# EAGLE design untitled (EAGLE 9.5.0)
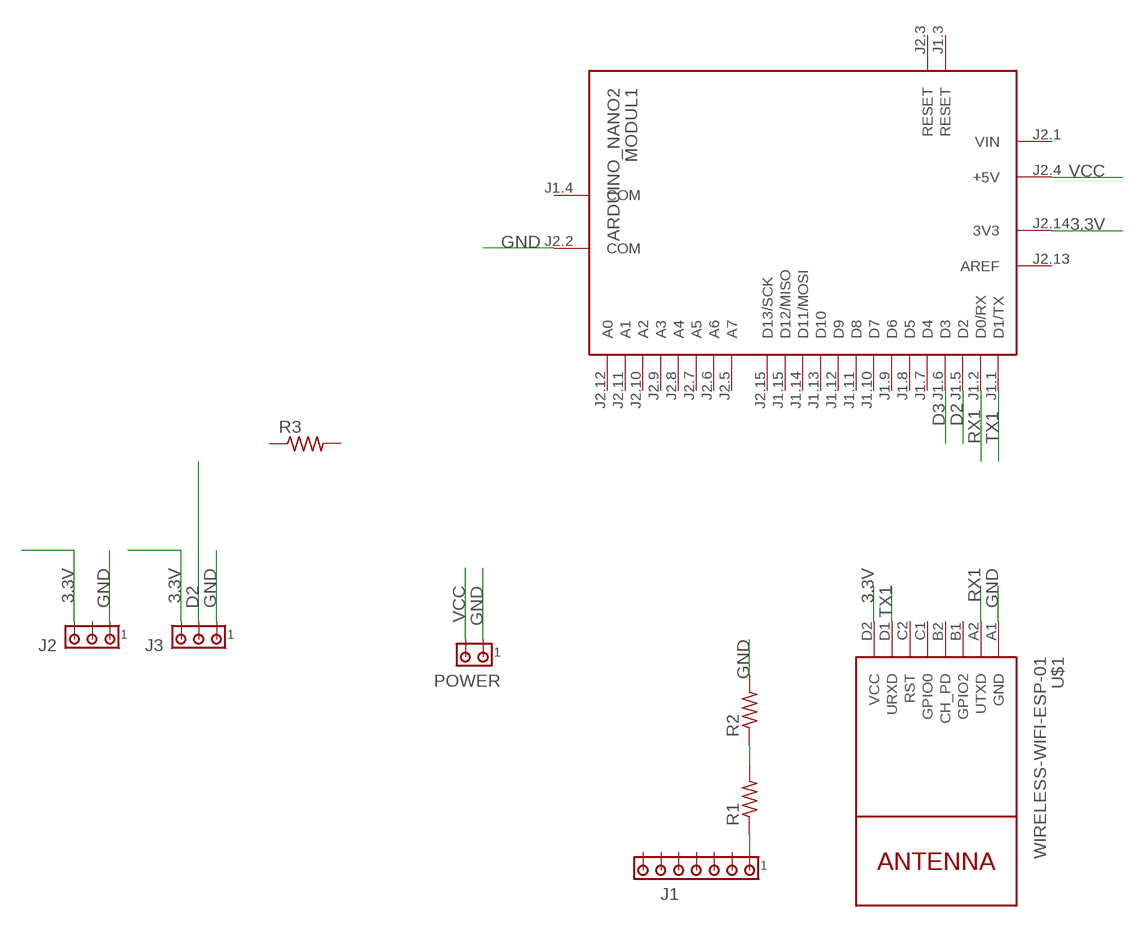
[diagram p0: schematic, sheet 1]

## Parts
J1  MTA07-100  [10X07MTA]
J2  MTA03-100  [10X03MTA]
J3  MTA03-100  [10X03MTA]
MODUL1  ARDUINO_NANO2  [ARDUINO_NANO2]
POWER  MTA02-100  [10X02MTA]
R1  R-US_0207/9  [0207/9]
R2  R-US_0207/9  [0207/9]
R3  R-US_0207/9  [0207/9]
U$1  WIRELESS-WIFI-ESP-01  [WIRELESS-WIFI-ESP-01]

## Nets
3.3V: J2.3 J3.3 MODUL1.J2.14(3V3) U$1.D2(VCC)
D2: J3.2 MODUL1.J1.5(D2)
D3: MODUL1.J1.6(D3)
GND: J2.1 J3.1 MODUL1.J2.2(COM) POWER.1 R2.2 U$1.A1(GND)
N$1: R1.2 R2.1
N$2: J1.1 R1.1
RX1: MODUL1.J1.2(D0/RX) U$1.A2(UTXD)
TX1: MODUL1.J1.1(D1/TX) U$1.D1(URXD)
VCC: MODUL1.J2.4(+5V) POWER.2
Unconnected: J1.2 J1.3 J1.4 J1.5 J1.6 J1.7 J2.2 MODUL1.J1.3(RESET) MODUL1.J1.7(D4) MODUL1.J1.8(D5) MODUL1.J1.9(D6) MODUL1.J1.10(D7) MODUL1.J1.11(D8) MODUL1.J1.12(D9) MODUL1.J1.13(D10) MODUL1.J1.14(D11/MOSI) MODUL1.J1.15(D12/MISO) MODUL1.J2.3(RESET) MODUL1.J2.5(A7) MODUL1.J2.6(A6) MODUL1.J2.7(A5) MODUL1.J2.8(A4) MODUL1.J2.9(A3) MODUL1.J2.10(A2) MODUL1.J2.11(A1) MODUL1.J2.12(A0) MODUL1.J2.15(D13/SCK) R3.1 R3.2 U$1.B1(GPIO2) U$1.B2(CH_PD) U$1.C1(GPIO0) U$1.C2(RST)

## Power pins joined to a net without a drawn wire
AREF: MODUL1.J2.13(AREF)
COM: MODUL1.J1.4(COM)
VIN: MODUL1.J2.1(VIN)

## Library data of the parts
J1 = con-amp:MTA07-100: AMP connector
J2 J3 = con-amp:MTA03-100: AMP connector
MODUL1 = arduino:ARDUINO_NANO2: Arduino Nano2 Auto generated by modulcreator.ulp \;; ANZAHL: 2; MODUL: TRUE; STECKX0: -76200; STECKX1: 76200; STECKY0: 177800; STECKY1: 177800
POWER = con-amp:MTA02-100: AMP connector
R1-R3 = adafruit:R-US_: RESISTOR, American symbol
U$1 = diy-modules:WIRELESS-WIFI-ESP-01: Wireless Wi-Fi ESP-01 Module based on ESP8266 chip Click here to find device on ebay.com <http://www.ebay.com/sch/esp8266+esp+01+transceiver>

## Board
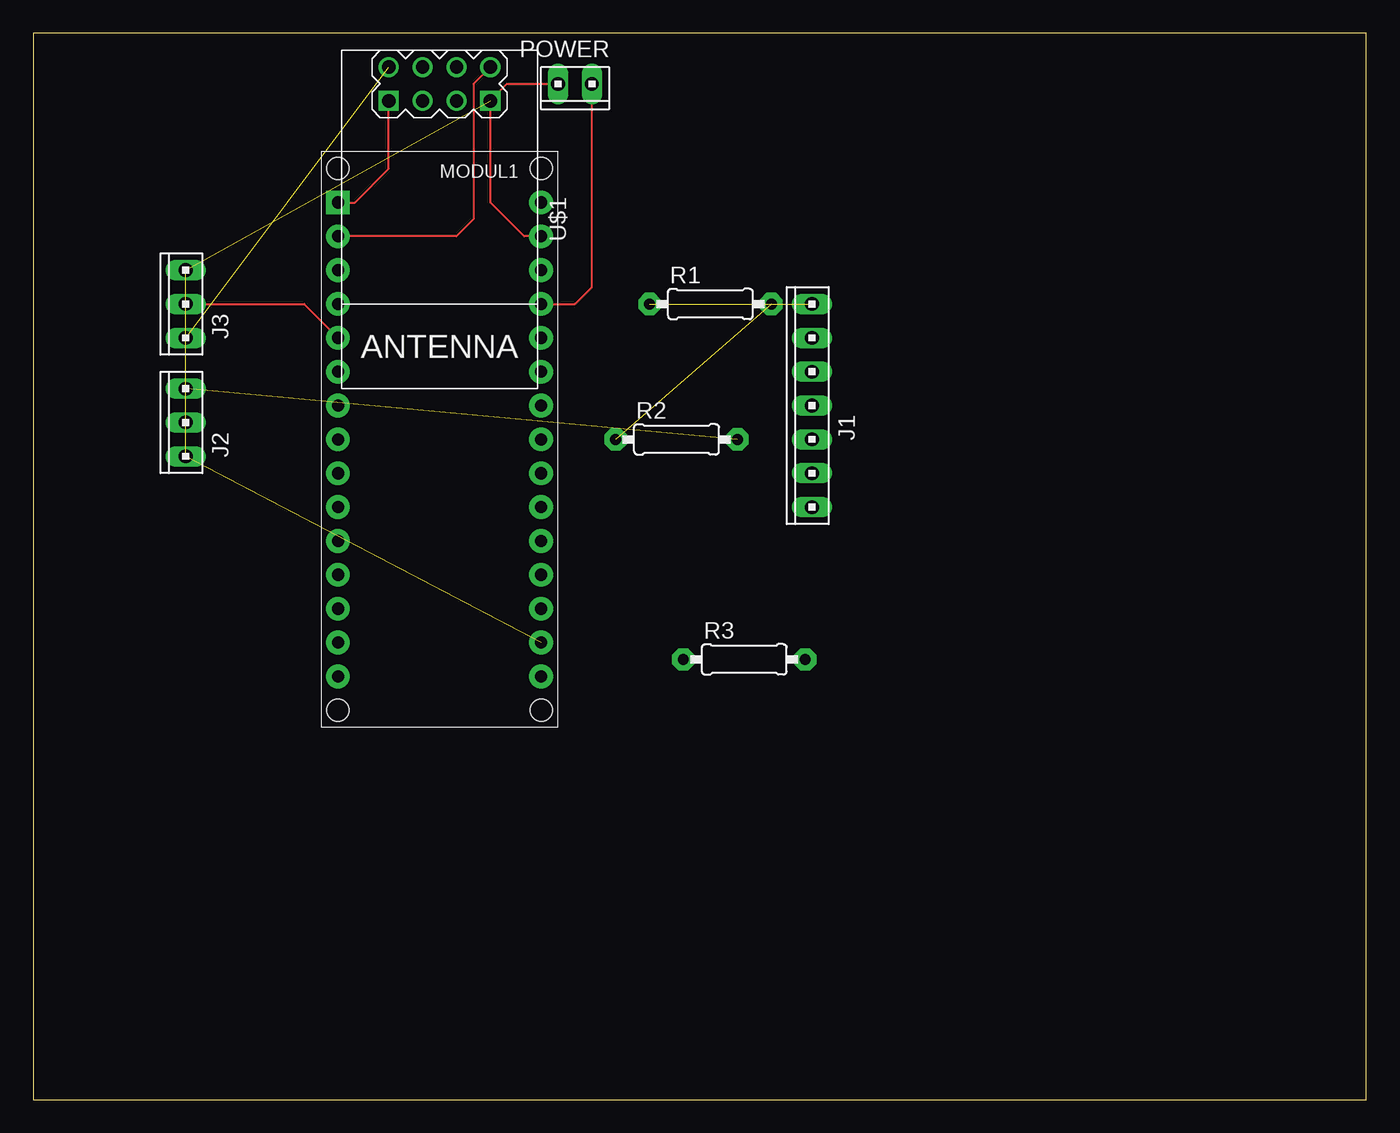
[diagram p1: board, top side]

Size 100 x 80 mm. Coordinates in mm from the lower left corner, seen from the top.
Outline: 0,0 100,0 100,80 0,80 0,0
Copper layers (1*16): Top 0.035mm / dielectric 1.5mm / Bottom 0.035mm
Design rules "default": minimum track width 6mil, minimum drill 0.35mm, track to track 6mil, track to pad 6mil, pad to pad 6mil, via to via 6mil, smd to smd 6mil, copper to edge 40mil, drill to drill 6mil, minimum pad ring 10mil, minimum via ring 8mil, stop-mask expansion 4mil, vias tented up to drill 0mil, thermal gap 10mil

### Footprints (pad centres in the part's own frame; a part is rotated, then mirrored left to right if it is on the bottom)
10X07MTA = drill 1.016 long: 1 7.62,0; 2 5.08,0; 3 2.54,0; 4 0,0; 5 -2.54,0; 6 -5.08,0; 7 -7.62,0
10X03MTA = drill 1.016 long: 1 2.54,0; 2 0,0; 3 -2.54,0
ARDUINO_NANO2 = drill 0.914 pad 1.778 square: J1.1 -7.62,17.78 | drill 0.914 pad 1.778: J1.2 -7.62,15.24; J1.3 -7.62,12.7; J1.4 -7.62,10.16; J1.5 -7.62,7.62; J1.6 -7.62,5.08; J1.7 -7.62,2.54; J1.8 -7.62,0; J1.9 -7.62,-2.54; J1.10 -7.62,-5.08; J1.11 -7.62,-7.62; J1.12 -7.62,-10.16; J1.13 -7.62,-12.7; J1.14 -7.62,-15.24; J1.15 -7.62,-17.78; J2.1 7.62,17.78; J2.2 7.62,15.24; J2.3 7.62,12.7; J2.4 7.62,10.16; J2.5 7.62,7.62; J2.6 7.62,5.08; J2.7 7.62,2.54; J2.8 7.62,0; J2.9 7.62,-2.54; J2.10 7.62,-5.08; J2.11 7.62,-7.62; J2.12 7.62,-10.16; J2.13 7.62,-12.7; J2.14 7.62,-15.24; J2.15 7.62,-17.78 | hole 1.651: -7.62,-20.32; 7.62,-20.32; 7.62,20.32; -7.62,20.32
10X02MTA = drill 1.016 long: 1 1.27,0; 2 -1.27,0
0207/9 = drill 0.813 pad 1.676 octagon: 1 -4.572,0; 2 4.572,0
WIRELESS-WIFI-ESP-01 = drill 1 square: A1 -8.89,3.81; D1 -8.89,-3.81 | drill 1: A2 -11.43,3.81; B1 -8.89,1.27; B2 -11.43,1.27; C1 -8.89,-1.27; C2 -11.43,-1.27; D2 -11.43,-3.81

### Placement (x,y rotation side)
J1  58.42,52.07 90 top
J2  11.43,50.8 90 top
J3  11.43,59.69 90 top
MODUL1  30.48,49.53 0 top
POWER  40.64,76.2 180 top
R1  50.8,59.69 0 top
R2  48.26,49.53 0 top
R3  53.34,33.02 0 top
U$1  30.48,66.04 270 top

### Tracks (layer width: path | path; a pad name or v marks a point on that pad's centre or on a via)
3.3V  (3 unrouted)
D2
  Top 0.152: J3.2 20.32,59.69 MODUL1.J1.5
GND  (3 unrouted)
  Top 0.152: POWER.1 35.56,76.2 U$1.A1 34.29,67.31 36.83,64.77 MODUL1.J2.2
N$1  (1 unrouted)
N$2  (1 unrouted)
RX1
  Top 0.152: U$1.A2 33.02,76.2 33.02,66.04 31.75,64.77 MODUL1.J1.2
TX1
  Top 0.152: MODUL1.J1.1 24.13,67.31 26.67,69.85 U$1.D1
VCC
  Top 0.152: MODUL1.J2.4 40.64,59.69 41.91,60.96 POWER.2